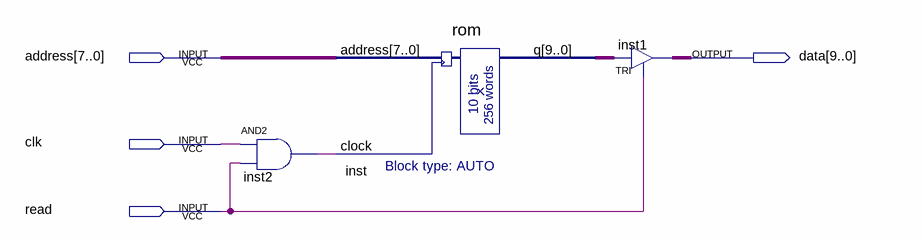
[diagram p0: schematic sheet]
// Quartus schematic rom0.bdf as structural Verilog: 3 symbols, 4 pins
module rom0 (
  input  [7:0] address,
  input  clk,
  input  read,
  output [9:0] data
);

  wire inst2_out;
  wire [9:0] inst_q;

  and inst2 (inst2_out, clk, read);
  rom inst (.address(address), .clock(inst2_out), .q(inst_q));
  TRI inst1[9:0] (.IN(inst_q), .OE(read), .OUT(data));
endmodule
